# Altium schematic sheet ESP32_Schem_V2.SchDoc (part 3 of 4)
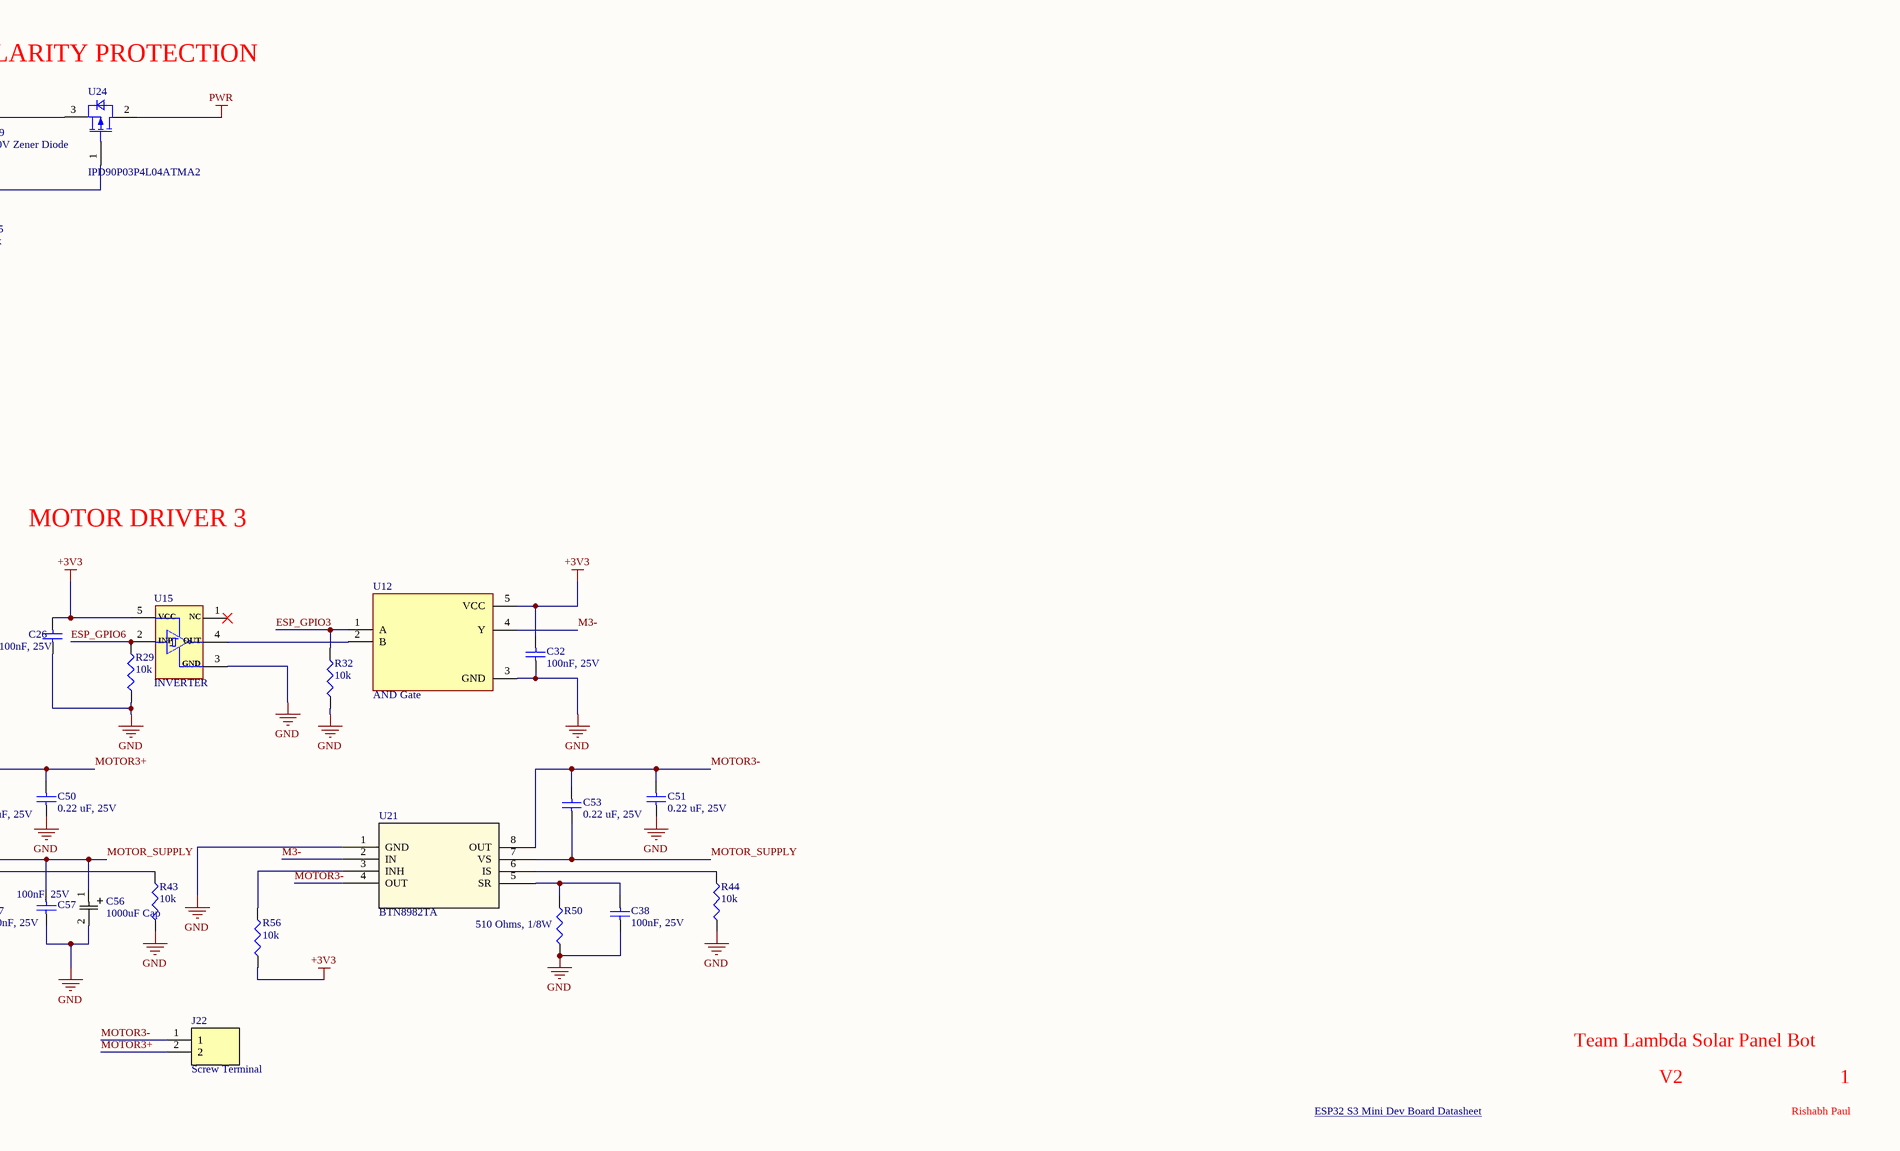
[diagram p5: ESP32_Schem_V2.SchDoc, bottom right]

## Library data of the parts (continued)
FB1 = BLM18AG601SN1D: FERRITE BEAD 600 OHM 0603 1LN; Manufacturer: Murata; Current Rating: 500mA; DC Resistance (DCR): 380mΩ; Frequency: 100MHz; Impedance: 600Ω; Material: Ferrite, Steel; Number of Circuits: 1; Value: 380mΩ; Shielding: Unshielded; Tolerance: 25%; Supplier: DigiKey; Supplier Part Number: 490-1014-1-ND; Manufacturer Part Number: BLM18AG601SN1D; RoHS: Compliant; Category: Ferrite Beads and Chips; Stock: 1399448; Pricing: 1=0.1, 10=0.057, 25=0.0496, 50=0.0446, 100=0.0401, 250=0.03456, 500=0.03076, 1000=0.02726 (USD); Case/Package: 0603; Case Code (Imperial): 0603; Case Code (Metric): 1608; Core Material: Ferrite; DC Current: 500mA; Depth: 800µm; Height: 800µm; Lead Free: Lead Free; Length: 1.6mm; Lifecycle Status: Production; Max Current Rating: 500mA; Max DC Current: 500mA; Clock Frequency: 100MHz; Max Operating Temperature: 125°C; Military Standard: Not; Min Operating Temperature: -55°C; Number of Lines: 1; Pins: 2; Number of Terminals: 2; Packaging: Cut Tape; Radiation Hardening: No; REACH SVHC: Yes; RMS Current (Irms): 500mA; Schedule B: 8543706000, 8543706000|8543706000, 8543706000|8543706000|8543706000, 8543706000|8543706000|8543706000|8543706000; ESR: 380mΩ; Termination: SMD/SMT; Test Frequency: 100MHz; Weight: 2.012816mg; Width: 800µm; ComponentLink1URL: https://datasheet.octopart.com:443/BLM18AG601SN1D-Murata-datasheet-180806579.pdf?src-supplier=IHS; ComponentLink1Description: https://datasheet.octopart.com:443/BLM18AG601SN1D-Murata-datasheet-180806579.pdf?src-supplier=IHS; ComponentLink2URL: https://datasheet.octopart.com:443/BLM18AG601SN1D-Murata-datasheet-41195.pdf?src-supplier=Upverter; ComponentLink2Description: https://datasheet.octopart.com:443/BLM18AG601SN1D-Murata-datasheet-41195.pdf?src-supplier=Upverter; ComponentLink3URL: https://datasheet.octopart.com:443/BLM18AG601SN1D-Murata-datasheet-11743096.pdf?src-supplier=Newark; ComponentLink3Description: https://datasheet.octopart.com:443/BLM18AG601SN1D-Murata-datasheet-11743096.pdf?src-supplier=Newark; ComponentLink4URL: https://datasheet.octopart.com:443/BLM18AG601SN1D-Murata-datasheet-5338592.pdf?src-supplier=Newark; ComponentLink4Description: https://datasheet.octopart.com:443/BLM18AG601SN1D-Murata-datasheet-5338592.pdf?src-supplier=Newark; ComponentLink5URL: https://datasheet.octopart.com:443/BLM18AG601SN1D-Murata-datasheet-511221.pdf?src-supplier=TME; ComponentLink5Description: https://datasheet.octopart.com:443/BLM18AG601SN1D-Murata-datasheet-511221.pdf?src-supplier=TME; ComponentLink6URL: https://datasheet.octopart.com:443/BLM18AG601SN1D-Murata-datasheet-135086656.pdf?src-supplier=TME; ComponentLink6Description: https://datasheet.octopart.com:443/BLM18AG601SN1D-Murata-datasheet-135086656.pdf?src-supplier=TME; ComponentLink7URL: https://datasheet.octopart.com:443/BLM18AG601SN1D-Murata-datasheet-5396529.pdf?src-supplier=Factory+Futures; ComponentLink7Description: https://datasheet.octopart.com:443/BLM18AG601SN1D-Murata-datasheet-5396529.pdf?src-supplier=Factory+Futures; ComponentLink8URL: https://datasheet.octopart.com:443/BLM18AG601SN1D-Murata-datasheet-141257898.pdf?src-supplier=Ciiva; ComponentLink8Description: https://datasheet.octopart.com:443/BLM18AG601SN1D-Murata-datasheet-141257898.pdf?src-supplier=Ciiva; ComponentLink9URL: https://datasheet.octopart.com:443/BLM18AG601SN1D-Murata-datasheet-138706784.pdf?src-supplier=Ciiva; ComponentLink9Description: https://datasheet.octopart.com:443/BLM18AG601SN1D-Murata-datasheet-138706784.pdf?src-supplier=Ciiva; ComponentLink10URL: https://datasheet.octopart.com:443/BLM18AG601SN1D-Murata-datasheet-78375072.pdf?src-supplier=Future+Electronics; ComponentLink10Description: https://datasheet.octopart.com:443/BLM18AG601SN1D-Murata-datasheet-78375072.pdf?src-supplier=Future+Electronics; ComponentLink11URL: https://datasheet.octopart.com:443/BLM18AG601SN1D-Murata-datasheet-58177255.pdf?src-supplier=Future+Electronics; ComponentLink11Description: https://datasheet.octopart.com:443/BLM18AG601SN1D-Murata-datasheet-58177255.pdf?src-supplier=Future+Electronics; ComponentLink12URL: https://datasheet.octopart.com/BLM18AG601SN1D-Murata-datasheet-37129980.pdf; ComponentLink12Description: https://datasheet.octopart.com/BLM18AG601SN1D-Murata-datasheet-37129980.pdf; ComponentLink13URL: https://datasheet.octopart.com:443/BLM18AG601SN1D-Murata-datasheet-14066397.pdf?src-supplier=iiiC; ComponentLink13Description: https://datasheet.octopart.com:443/BLM18AG601SN1D-Murata-datasheet-14066397.pdf?src-supplier=iiiC; ComponentLink14URL: https://datasheet.octopart.com:443/BLM18AG601SN1D-Murata-datasheet-9604654.pdf?src-supplier=RS+(Formerly+Allied+Electronics); ComponentLink14Description: https://datasheet.octopart.com:443/BLM18AG601SN1D-Murata-datasheet-9604654.pdf?src-supplier=RS+(Formerly+Allied+Electronics); ComponentLink15URL: https://datasheet.octopart.com:443/BLM18AG601SN1D-Murata-datasheet-13143.pdf?src-supplier=RS+(Formerly+Allied+Electronics); ComponentLink15Description: https://datasheet.octopart.com:443/BLM18AG601SN1D-Murata-datasheet-13143.pdf?src-supplier=RS+(Formerly+Allied+Electronics); ComponentLink16URL: https://datasheet.octopart.com:443/BLM18AG601SN1D-Murata-datasheet-7628479.pdf?src-supplier=Jameco; ComponentLink16Description: https://datasheet.octopart.com:443/BLM18AG601SN1D-Murata-datasheet-7628479.pdf?src-supplier=Jameco; ComponentLink17URL: https://datasheet.octopart.com:443/BLM18AG601SN1D-Murata-datasheet-11030792.pdf?src-supplier=Farnell; ComponentLink17Description: https://datasheet.octopart.com:443/BLM18AG601SN1D-Murata-datasheet-11030792.pdf?src-supplier=Farnell; ComponentLink18URL: http://sigma.octopart.com:80/reach_statement/Murata-company-16.pdf?src-supplier=Compliance+Statements; ComponentLink18Description: http://sigma.octopart.com:80/reach_statement/Murata-company-16.pdf?src-supplier=Compliance+Statements; LCSC Part Number: C19330
J3-J5 = BM04B-SRSS-TB: CONN HEADER SMD 4POS 1MM; Manufacturer: JST; Supplier: Digikey; Supplier Part Number: 455-BM04B-SRSS-TBCT-ND; Manufacturer Part Number: BM04B-SRSS-TB; RoHS: No; Category: Connectors; Stock: 53526; Pricing: 1=0.52, 10=0.44, 100=0.3739, 500=0.33366 (USD); ComponentLink1URL: https://datasheet.ciiva.com/6892/sr20connector-6892272.pdf?src-supplier=Digikey; ComponentLink1Description: https://datasheet.ciiva.com/6892/sr20connector-6892272.pdf?src-supplier=Digikey; LCSC Part Number: C160390
J6 J7 = B5B-XH-A: CONN HEADER VERT 5POS 2.5MM; Manufacturer: JST; Supplier: Digikey; Supplier Part Number: 455-B5B-XH-A-ND; Manufacturer Part Number: B5B-XH-A; RoHS: Yes; Category: FFC / FPC; Stock: 173083; Pricing: 1=0.17, 10=0.144, 100=0.1225, 500=0.10932, 1000=0.10409, 5000=0.0929, 10000=0.08847 (USD); ComponentLink1URL: https://www.distrelec.biz/Web/Downloads/_t/ds/xh-series_eng_tds.pdf?mime=application%2Fpdf&src-supplier=Distrelec; ComponentLink1Description: https://www.distrelec.biz/Web/Downloads/_t/ds/xh-series_eng_tds.pdf?mime=application%2Fpdf&src-supplier=Distrelec; LCSC Part Number: C157991
J8 = FTS-102-01-F-S: Board Connector, 2 Contact(s), 1 Row(s), Male, Straight, Solder Terminal; Manufacturer: Samtec; Manufacturer Series: FTS; Option: General Purpose; Additional Feature: Low Profile; Filter Feature: No; Number of Rows Loaded: 1; Number of Contacts: 2; Supplier: Digikey; Supplier Part Number: SAM15176-ND; Manufacturer Part Number: FTS-102-01-F-S; RoHS: Yes; Category: Connectors; Stock: 145; Pricing: 1=0.49, 50=0.4252, 100=0.3608, 500=0.2994, 1000=0.25609, 2000=0.252 (USD); Mounting Technology: Board; Contact Material: Bronze; Contact Finish - Mating: GOLD (3) OVER NICKEL (50); Contact Finish - Termination: Matte Tin (Sn) - with Nickel (Ni) barrier; Connector Type: BOARD CONNECTOR; JESD-609 Code: e3; Contact Gender: Male; Mixed Contacts: No; Mounting Style: STRAIGHT; Termination: Solder; Terminal Pitch: 1.27mm; Flammability Rating: UL94 V-0; DIN Conformance: No; IEC Conformance: No; MIL Conformance: No; Reach SVHC Compliant: Yes; RoHS Compliant: Yes; ComponentLink1URL: https://datasheet.ciiva.com:443/pdfs/VipMasterIC/IC/SAMI/SAMI-S-A0001504673/SAMI-S-A0001504673-1.pdf?src-supplier=IHS+Markit; ComponentLink1Description: https://datasheet.ciiva.com:443/pdfs/VipMasterIC/IC/SAMI/SAMI-S-A0001504673/SAMI-S-A0001504673-1.pdf?src-supplier=IHS+Markit; ComponentLink2URL: http://www.samtec.com/documents/webfiles/pdf/FTS.pdf?src-supplier=Avnet; ComponentLink2Description: http://www.samtec.com/documents/webfiles/pdf/FTS.pdf?src-supplier=Avnet; ComponentLink3URL: https://datasheet.octopart.com/FTS-102-01-F-S-Samtec-datasheet-118493358.pdf?src-supplier=Electro+Sonic; ComponentLink3Description: https://datasheet.octopart.com/FTS-102-01-F-S-Samtec-datasheet-118493358.pdf?src-supplier=Electro+Sonic; LCSC Part Number: C6045317
J10 J19 J20 J22 J23 = TB005-762-02BE: 2~24 Poles, Screw Type, Horizontal, 7.62 Pitch, 26~10 (AWG), Terminal Block Connector; Manufacturer: Same Sky; Approvals: CE, EN, IEC, UL, cUL; Current Rating: 30A; Number of Contacts: 2; Number of Levels: 1; Pitch: 7.62mm; Voltage Rating: 300V; Wire/Cable Gauge: 10AWG; Supplier: DigiKey; Supplier Part Number: 102-6189-ND; Manufacturer Part Number: TB005-762-02BE; RoHS: Compliant; Category: Terminal Blocks; Stock: 25079; Pricing: 1=0.78, 10=0.574, 25=0.5, 50=0.4504, 100=0.4073, 250=0.36028, 600=0.3253, 1200=0.30358, 5400=0.27068 (USD); Color: Blue; Height: 21.7mm; Lifecycle Status: Production; Max Operating Temperature: 105°C; Min Operating Temperature: -40°C; Mounting Technology: Screw; Number of Rows: 1; Orientation: Horizontal; REACH SVHC: No; Width: 12.6mm; ComponentLink1URL: https://datasheet.octopart.com:443/TB005-762-02BE-Same-Sky-datasheet-181920257.pdf?src-supplier=Same+Sky; ComponentLink1Description: https://datasheet.octopart.com:443/TB005-762-02BE-Same-Sky-datasheet-181920257.pdf?src-supplier=Same+Sky; ComponentLink2URL: https://datasheet.octopart.com:443/TB005-762-02BE-Same-Sky-datasheet-181920256.pdf?src-supplier=Same+Sky; ComponentLink2Description: https://datasheet.octopart.com:443/TB005-762-02BE-Same-Sky-datasheet-181920256.pdf?src-supplier=Same+Sky; ComponentLink3URL: https://datasheet.octopart.com:443/TB005-762-02BE-CUI-Devices-datasheet-175928138.pdf?src-supplier=Same+Sky; ComponentLink3Description: https://datasheet.octopart.com:443/TB005-762-02BE-CUI-Devices-datasheet-175928138.pdf?src-supplier=Same+Sky; ComponentLink4URL: https://datasheet.octopart.com:443/TB005-762-02BE-CUI-Devices-datasheet-144794958.pdf?src-supplier=Same+Sky; ComponentLink4Description: https://datasheet.octopart.com:443/TB005-762-02BE-CUI-Devices-datasheet-144794958.pdf?src-supplier=Same+Sky; ComponentLink5URL: https://datasheet.octopart.com:443/TB005-762-02BE-CUI-Devices-datasheet-180438487.pdf?src-supplier=IHS; ComponentLink5Description: https://datasheet.octopart.com:443/TB005-762-02BE-CUI-Devices-datasheet-180438487.pdf?src-supplier=IHS; ComponentLink6URL: https://datasheet.octopart.com:443/TB005-762-02BE-Same-Sky-datasheet-182881445.pdf?src-supplier=Electro+Sonic; ComponentLink6Description: https://datasheet.octopart.com:443/TB005-762-02BE-Same-Sky-datasheet-182881445.pdf?src-supplier=Electro+Sonic; ComponentLink7URL: https://datasheet.octopart.com:443/TB005-762-02BE-CUI-Devices-datasheet-154730746.pdf?src-supplier=Electro+Sonic; ComponentLink7Description: https://datasheet.octopart.com:443/TB005-762-02BE-CUI-Devices-datasheet-154730746.pdf?src-supplier=Electro+Sonic; ComponentLink8URL: https://datasheet.octopart.com:443/TB005-762-02BE-CUI-Devices-datasheet-175927971.pdf?src-supplier=CUI+Devices+SCT; ComponentLink8Description: https://datasheet.octopart.com:443/TB005-762-02BE-CUI-Devices-datasheet-175927971.pdf?src-supplier=CUI+Devices+SCT; ComponentLink9URL: https://datasheet.octopart.com:443/TB005-762-02BE-CUI-Devices-datasheet-142371921.pdf?src-supplier=Future+Electronics; ComponentLink9Description: https://datasheet.octopart.com:443/TB005-762-02BE-CUI-Devices-datasheet-142371921.pdf?src-supplier=Future+Electronics; ComponentLink10URL: https://datasheet.octopart.com:443/TB005-762-02BE-Same-Sky-datasheet-182050252.pdf?src-supplier=Future+Electronics; ComponentLink10Description: https://datasheet.octopart.com:443/TB005-762-02BE-Same-Sky-datasheet-182050252.pdf?src-supplier=Future+Electronics; ComponentLink11URL: https://datasheet.octopart.com:443/TB005-762-02BE-CUI-Devices-datasheet-175928503.pdf?src-supplier=Future+Electronics; ComponentLink11Description: https://datasheet.octopart.com:443/TB005-762-02BE-CUI-Devices-datasheet-175928503.pdf?src-supplier=Future+Electronics; ComponentLink12URL: https://datasheet.octopart.com:443/TB005-762-02BE-CUI-Devices-datasheet-147843964.pdf?src-supplier=Future+Electronics; ComponentLink12Description: https://datasheet.octopart.com:443/TB005-762-02BE-CUI-Devices-datasheet-147843964.pdf?src-supplier=Future+Electronics; ComponentLink13URL: https://datasheet.octopart.com:443/TB005-762-02BE-Same-Sky-datasheet-189105715.pdf?src-supplier=Master+Electronics; ComponentLink13Description: https://datasheet.octopart.com:443/TB005-762-02BE-Same-Sky-datasheet-189105715.pdf?src-supplier=Master+Electronics; ComponentLink14URL: https://octopart.com:443/opatz8j6/c1?t=UaLs9BzQFnAOJB9prTnk7hYAEqibQSv_UZhUrY86DPf-p0P0hX05E_pze_DW6cL4J_MzA2LUb1YOWKK86-5mpMQQU3DWYVuZIoukJg4Hh9bczH7CnkQxGFzuqKqtirzWJe-6GAELDRl62KmKpAdnnPg1TQOtKshj70we-Zluz0qtI-26UObxFmwPsUgEbo_7o4hJKMXvNacg0FBUhbjGVTtEzE_3AW52qU7r6OuDn6MyCvvcIhP6l0xxBDI7L6vG1RQTPJKu5j4wHDn_7LFUbOdZOzPXgt-E1wVzunH8sE2WAnC8CwCpFNFDDf2LEElRT3GQEArGzVR9jHU4ckIzmEN6zODhzVqwCy90tTlm&src-supplier=Compliance+Statements; ComponentLink14Description: https://octopart.com:443/opatz8j6/c1?t=UaLs9BzQFnAOJB9prTnk7hYAEqibQSv_UZhUrY86DPf-p0P0hX05E_pze_DW6cL4J_MzA2LUb1YOWKK86-5mpMQQU3DWYVuZIoukJg4Hh9bczH7CnkQxGFzuqKqtirzWJe-6GAELDRl62KmKpAdnnPg1TQOtKshj70we-Zluz0qtI-26UObxFmwPsUgEbo_7o4hJKMXvNacg0FBUhbjGVTtEzE_3AW52qU7r6OuDn6MyCvvcIhP6l0xxBDI7L6vG1RQTPJKu5j4wHDn_7LFUbOdZOzPXgt-E1wVzunH8sE2WAnC8CwCpFNFDDf2LEElRT3GQEArGzVR9jHU4ckIzmEN6zODhzVqwCy90tTlm&src-supplier=Compliance+Statements; ComponentLink15URL: https://octopart.com:443/opatz8j6/c1?t=DnoQ13F0DlpqmGN8T_YXuK1tRMjg7pOtrEexqg8E5gzx3sX052Z7C9OransOEA1B1UKr9za9I5GPF3spWl0seeHLvZoR3j5pxqaHFy_IKDPQmLXnkoJAym92fy25UN33V-8Qm6tbHVt5VO_bllWVtdDekc0YECabXnkKPqjitvax55qCo91aF91MvdJWz6TDxIrCDIwXhNHgV3TM4Wj5aU3mEGqXoFgBytK3VCRqYa7hOyW9naNxJLLkwI4ACkSaLfD6gpPqjencvKCWF0Lf8nWVAbEAGs7-_nreDZocLrEZI-9ZfwSveC2jq_y-Kh72xlf7IlgtV_ZwQpY6ti08_7N9ZHeZ6iN9_D3cDOu3zpL8bA&src-supplier=Compliance+Statements; ComponentLink15Description: https://octopart.com:443/opatz8j6/c1?t=DnoQ13F0DlpqmGN8T_YXuK1tRMjg7pOtrEexqg8E5gzx3sX052Z7C9OransOEA1B1UKr9za9I5GPF3spWl0seeHLvZoR3j5pxqaHFy_IKDPQmLXnkoJAym92fy25UN33V-8Qm6tbHVt5VO_bllWVtdDekc0YECabXnkKPqjitvax55qCo91aF91MvdJWz6TDxIrCDIwXhNHgV3TM4Wj5aU3mEGqXoFgBytK3VCRqYa7hOyW9naNxJLLkwI4ACkSaLfD6gpPqjencvKCWF0Lf8nWVAbEAGs7-_nreDZocLrEZI-9ZfwSveC2jq_y-Kh72xlf7IlgtV_ZwQpY6ti08_7N9ZHeZ6iN9_D3cDOu3zpL8bA&src-supplier=Compliance+Statements; ComponentLink16URL: https://octopart.com:443/opatz8j6/c1?t=9TOIpc8Qr-PjoInF58_SetXl4A-zcD2bg-RG2s0eGx3VZJ_3ffKwdLF0jkFcls3hR0nNbTXhk3LbUTlV1wcsn2gUmTNq_ymOT4yZcUsxc4MnTfKTQUXl8BiPhcap6BnyTO4DP62xPlcbfDdOl1kdyUnwLJKClBaAfVfvVHvvu8Dg5xKYLUwzSzHOVNnhawJNiUJdYmvbYXoByG5W0OcRVNpAAEvWODy5ARTJtlpfI1W4UHjPZ1NOhOXf6h4eMswP7ZdtGUQDglbSWcDc-Kt2pCaeZ17Pt05QbPX0un0LSt1LSPowuvCYICYvdiB4Rp6OR5QS3GWcy18acTGixr9Sk1CdixVzswMZQndrdbpP&src-supplier=Compliance+Statements; ComponentLink16Description: https://octopart.com:443/opatz8j6/c1?t=9TOIpc8Qr-PjoInF58_SetXl4A-zcD2bg-RG2s0eGx3VZJ_3ffKwdLF0jkFcls3hR0nNbTXhk3LbUTlV1wcsn2gUmTNq_ymOT4yZcUsxc4MnTfKTQUXl8BiPhcap6BnyTO4DP62xPlcbfDdOl1kdyUnwLJKClBaAfVfvVHvvu8Dg5xKYLUwzSzHOVNnhawJNiUJdYmvbYXoByG5W0OcRVNpAAEvWODy5ARTJtlpfI1W4UHjPZ1NOhOXf6h4eMswP7ZdtGUQDglbSWcDc-Kt2pCaeZ17Pt05QbPX0un0LSt1LSPowuvCYICYvdiB4Rp6OR5QS3GWcy18acTGixr9Sk1CdixVzswMZQndrdbpP&src-supplier=Compliance+Statements; ComponentLink17URL: https://octopart.com:443/opatz8j6/c1?t=3V4tUB9kiYrWGahfebCrvcXlmg8iqF7sOAlCR_IUY1WwO2F75QSEOxDuLjKYVwOKylXrvvAE0jhvyxpY5kpkHqUuzaMRj71z5KzuQkpAngx-BdZlTUzZtYpvhoyf9gXv6BqVIVx6Lus7sZ4tMtHFDPJOpaCFtvYA__49iWvip8OBtn2jUAviupDwUVxZ3ovJ42WilRB767x17euwvMlr75_c4O8Lf_S7SD5GFBqRkxeFqIQWstxwZM20vhpFCia3KeU3jEgmGWsk6Gphu4sZVVI-8_cX-rxiwCWaSbFipS2rdSeaRV-fARs0Qm9gBHXX2FNK0VQTZmSv-MV2ywYDx4-u10J-zFhb313JbJN9nWfhrw&src-supplier=Compliance+Statements; ComponentLink17Description: https://octopart.com:443/opatz8j6/c1?t=3V4tUB9kiYrWGahfebCrvcXlmg8iqF7sOAlCR_IUY1WwO2F75QSEOxDuLjKYVwOKylXrvvAE0jhvyxpY5kpkHqUuzaMRj71z5KzuQkpAngx-BdZlTUzZtYpvhoyf9gXv6BqVIVx6Lus7sZ4tMtHFDPJOpaCFtvYA__49iWvip8OBtn2jUAviupDwUVxZ3ovJ42WilRB767x17euwvMlr75_c4O8Lf_S7SD5GFBqRkxeFqIQWstxwZM20vhpFCia3KeU3jEgmGWsk6Gphu4sZVVI-8_cX-rxiwCWaSbFipS2rdSeaRV-fARs0Qm9gBHXX2FNK0VQTZmSv-MV2ywYDx4-u10J-zFhb313JbJN9nWfhrw&src-supplier=Compliance+Statements; LCSC Part Number: C5873515
J13 J17 = 1725656: Block, Terminal; 6 A; 63 V; 2.54 mm; 26 to 20 AWG; 2; Screw; Soldering; 1.5 kV; Manufacturer: Phoenix Contact; Approvals: CSA, UL, VDE, cUL; Connector Type: PCB, Screw, Terminal Block; Current: 6A; Max Supply Voltage: 63V; Number of Circuits: 2; Number of Levels: 1; Pitch: 2.54mm; Stripping Length: 4.5mm; Voltage: 125V; Voltage Rating: 160V; Wire/Cable Gauge: 20AWG; Wire Gauge (Max): 26AWG; Supplier: DigiKey; Supplier Part Number: 277-1273-ND; Manufacturer Part Number: 1725656; RoHS: Compliant; Category: Terminal Blocks; Stock: 21108; Pricing: 1=1.93, 10=1.379, 25=1.2736 (USD); ComponentLink1URL: https://datasheet.octopart.com:443/1725656-Phoenix-Contact-datasheet-141439143.pdf?src-supplier=Upverter; ComponentLink1Description: https://datasheet.octopart.com:443/1725656-Phoenix-Contact-datasheet-141439143.pdf?src-supplier=Upverter; ComponentLink2URL: https://datasheet.octopart.com:443/1725656-Phoenix-Contact-datasheet-101586919.pdf?src-supplier=element14+APAC; ComponentLink2Description: https://datasheet.octopart.com:443/1725656-Phoenix-Contact-datasheet-101586919.pdf?src-supplier=element14+APAC; China RoHS: Compliant; Color: Green; Contact Material: Tin; Current Rating: 6A; Depth: 6.2mm; Flammability Rating: UL94 V-0; Height: 6.2mm; Housing Color: Green; Insulation Material: Nylon; Lead Free: Lead Free; Lead Pitch: 2.54mm; Lifecycle Status: Production; Max Current Rating: 6A; Mounting Technology: Screw; Number of Contacts: 2; Pins: 2; Number of Poles: 2; Number of Positions: 2; Number of Positions Per Level: 2; Number of Rows: 1; Radiation Hardening: No; REACH SVHC: Yes; Termination: Solder; Voltage Rating (AC): 63V; Weight: 639.990485mg; Width: 12mm; Wire Gauge (Min): 20AWG; ComponentLink3URL: https://datasheet.octopart.com:443/1725656-Phoenix-Contact-datasheet-5302866.pdf?src-supplier=element14+APAC; ComponentLink3Description: https://datasheet.octopart.com:443/1725656-Phoenix-Contact-datasheet-5302866.pdf?src-supplier=element14+APAC; ComponentLink4URL: https://datasheet.octopart.com:443/1725656-Phoenix-Contact-datasheet-66629008.pdf?src-supplier=element14+APAC; ComponentLink4Description: https://datasheet.octopart.com:443/1725656-Phoenix-Contact-datasheet-66629008.pdf?src-supplier=element14+APAC; ComponentLink5URL: https://datasheet.octopart.com:443/1725656-Phoenix-Contact-datasheet-170281659.pdf?src-supplier=Master+Electronics; ComponentLink5Description: https://datasheet.octopart.com:443/1725656-Phoenix-Contact-datasheet-170281659.pdf?src-supplier=Master+Electronics; ComponentLink6URL: https://datasheet.octopart.com:443/1725656-Phoenix-Contact-datasheet-154778688.pdf?src-supplier=Electro+Sonic; ComponentLink6Description: https://datasheet.octopart.com:443/1725656-Phoenix-Contact-datasheet-154778688.pdf?src-supplier=Electro+Sonic; ComponentLink7URL: https://datasheet.octopart.com:443/1725656-Phoenix-Contact-datasheet-525036.pdf?src-supplier=Newark; ComponentLink7Description: https://datasheet.octopart.com:443/1725656-Phoenix-Contact-datasheet-525036.pdf?src-supplier=Newark; ComponentLink8URL: https://datasheet.octopart.com:443/1725656-Phoenix-Contact-datasheet-169855803.pdf?src-supplier=Amar+Radio+Corporation; ComponentLink8Description: https://datasheet.octopart.com:443/1725656-Phoenix-Contact-datasheet-169855803.pdf?src-supplier=Amar+Radio+Corporation; ComponentLink9URL: https://datasheet.octopart.com:443/1725656-Phoenix-Contact-datasheet-164874127.pdf?src-supplier=Burklin+Elektronik; ComponentLink9Description: https://datasheet.octopart.com:443/1725656-Phoenix-Contact-datasheet-164874127.pdf?src-supplier=Burklin+Elektronik; ComponentLink10URL: https://datasheet.octopart.com:443/1725656-Phoenix-Contact-datasheet-62053918.pdf?src-supplier=TME; ComponentLink10Description: https://datasheet.octopart.com:443/1725656-Phoenix-Contact-datasheet-62053918.pdf?src-supplier=TME; ComponentLink11URL: https://datasheet.octopart.com:443/1725656-Phoenix-Contact-datasheet-11891466.pdf?src-supplier=Arrow+Electronics; ComponentLink11Description: https://datasheet.octopart.com:443/1725656-Phoenix-Contact-datasheet-11891466.pdf?src-supplier=Arrow+Electronics; ComponentLink12URL: https://datasheet.octopart.com:443/1725656-Phoenix-Contact-datasheet-33456951.pdf?src-supplier=MRO+Stop; ComponentLink12Description: https://datasheet.octopart.com:443/1725656-Phoenix-Contact-datasheet-33456951.pdf?src-supplier=MRO+Stop; ComponentLink13URL: https://datasheet.octopart.com:443/1725656-Phoenix-Contact-datasheet-62122436.pdf?src-supplier=RS+(Formerly+Allied+Electronics); ComponentLink13Description: https://datasheet.octopart.com:443/1725656-Phoenix-Contact-datasheet-62122436.pdf?src-supplier=RS+(Formerly+Allied+Electronics); ComponentLink14URL: https://datasheet.octopart.com:443/1725656-Phoenix-Contact-datasheet-9781713.pdf?src-supplier=RS+(Formerly+Allied+Electronics); ComponentLink14Description: https://datasheet.octopart.com:443/1725656-Phoenix-Contact-datasheet-9781713.pdf?src-supplier=RS+(Formerly+Allied+Electronics); ComponentLink15URL: https://datasheet.octopart.com:443/1725656-Phoenix-Contact-datasheet-84491.pdf?src-supplier=RS+(Formerly+Allied+Electronics); ComponentLink15Description: https://datasheet.octopart.com:443/1725656-Phoenix-Contact-datasheet-84491.pdf?src-supplier=RS+(Formerly+Allied+Electronics); ComponentLink16URL: https://datasheet.octopart.com:443/1725656-Phoenix-Contact-datasheet-657280.pdf?src-supplier=Farnell; ComponentLink16Description: https://datasheet.octopart.com:443/1725656-Phoenix-Contact-datasheet-657280.pdf?src-supplier=Farnell; ComponentLink17URL: https://datasheet.octopart.com:443/1725656-Phoenix-Contact-datasheet-97278.pdf?src-supplier=DigiKey; ComponentLink17Description: https://datasheet.octopart.com:443/1725656-Phoenix-Contact-datasheet-97278.pdf?src-supplier=DigiKey; LCSC Part Number: C3029316
J14 = FTS-103-01-F-S: Board Connector, 3 Contact(s), 1 Row(s), Male, Straight, Solder Terminal; Manufacturer: Samtec; Manufacturer Series: FTS; Option: General Purpose; Additional Feature: Low Profile; Filter Feature: No; Number of Rows Loaded: 1; Number of Contacts: 3; Supplier: Digikey; Supplier Part Number: 612-FTS-103-01-F-S-ND; Manufacturer Part Number: FTS-103-01-F-S; RoHS: Yes; Category: Connectors; Stock: 1328; Pricing: 1=0.73, 50=0.6378, 100=0.5407, 500=0.4491, 1000=0.38362, 2000=0.31431, 5000=0.2478, 10000=0.228 (USD); Mounting Technology: Board; Contact Material: Bronze; Contact Finish - Mating: GOLD (3) OVER NICKEL (50); Contact Finish - Termination: Matte Tin (Sn) - with Nickel (Ni) barrier; Connector Type: BOARD CONNECTOR; JESD-609 Code: e3; Contact Gender: Male; Mixed Contacts: No; Mounting Style: STRAIGHT; Termination: Solder; Terminal Pitch: 1.27mm; Flammability Rating: UL94 V-0; DIN Conformance: No; IEC Conformance: No; MIL Conformance: No; Reach SVHC Compliant: Yes; RoHS Compliant: Yes; ComponentLink1URL: https://datasheet.ciiva.com:443/pdfs/VipMasterIC/IC/SAMI/SAMI-S-A0001504673/SAMI-S-A0001504673-1.pdf?src-supplier=IHS+Markit; ComponentLink1Description: https://datasheet.ciiva.com:443/pdfs/VipMasterIC/IC/SAMI/SAMI-S-A0001504673/SAMI-S-A0001504673-1.pdf?src-supplier=IHS+Markit; ComponentLink2URL: http://suddendocs.samtec.com/prints/fts-1xx-xx-xx-xx-xx-mkt.pdf?src-supplier=Digikey; ComponentLink2Description: http://suddendocs.samtec.com/prints/fts-1xx-xx-xx-xx-xx-mkt.pdf?src-supplier=Digikey; ComponentLink3URL: http://www.samtec.com/documents/webfiles/pdf/FTS.pdf?src-supplier=Avnet; ComponentLink3Description: http://www.samtec.com/documents/webfiles/pdf/FTS.pdf?src-supplier=Avnet; ComponentLink4URL: https://datasheet.octopart.com/FTS-103-01-F-S-Samtec-datasheet-116535195.pdf?src-supplier=Toby+Electronics; ComponentLink4Description: https://datasheet.octopart.com/FTS-103-01-F-S-Samtec-datasheet-116535195.pdf?src-supplier=Toby+Electronics; ComponentLink5URL: https://datasheet.octopart.com/FTS-103-01-F-S-Samtec-datasheet-151470456.pdf?src-supplier=Sager+Electronics; ComponentLink5Description: https://datasheet.octopart.com/FTS-103-01-F-S-Samtec-datasheet-151470456.pdf?src-supplier=Sager+Electronics; ComponentLink6URL: https://datasheet.octopart.com/FTS-103-01-F-S-Samtec-datasheet-118493358.pdf?src-supplier=Electro+Sonic; ComponentLink6Description: https://datasheet.octopart.com/FTS-103-01-F-S-Samtec-datasheet-118493358.pdf?src-supplier=Electro+Sonic; LCSC Part Number: C3333578
J18 = 217179-0001: USB Connector, 16 Contact(s), Female, Right Angle, Surface Mount Terminal, Locking, Receptacle; Manufacturer: Molex; Supplier: Digikey; Supplier Part Number: 900-2171790001CT-ND; Manufacturer Part Number: 217179-0001; RoHS: No; Category: Connectors; Stock: 25209; Pricing: 1=0.83, 10=0.704, 25=0.6596, 50=0.628, 100=0.598, 250=0.56052, 500=0.53374 (USD); LCSC Part Number: C3197684
L1 = VLS6045EX-3R3N: FIXED IND 3.3UH 4.95A 30MOHM SMD; Manufacturer: TDK; Core Material: Ferrite; Tolerance: 30%; Case/Size Code: 2424; DC Resistance (DCR): 23mR; Inductor Application: POWER INDUCTOR; Inductor Type: GENERAL PURPOSE INDUCTOR; Channels: 1; Shape/Size Description: RECTANGULAR PACKAGE; Shielding: Shielded; Test Frequency: 100kHz; Package Height: 4.5mm; Package Length: 6mm; Supplier: Digikey; Supplier Part Number: 445-173052-1-ND; Manufacturer Part Number: VLS6045EX-3R3N; RoHS: Yes; Category: Fixed Inductors; Stock: 79866; Pricing: 1=0.34, 10=0.284, 100=0.2333 (USD); Pins: 2; Min Operating Temperature: -40°C; Max Operating Temperature: 105°C; Construction: Rectangular; Inductance-Nom (L): 3.3uH; Package Style: SMTMeter; Packaging: Tape and Reel; Max Current Rating: 4.95A; Surface Mount: Yes; Terminal Placement: Dual Ended; Termination: One Surface; Package Width: 6mm; Reach SVHC Compliant: Yes; RoHS Compliant: Yes; ComponentLink1URL: https://datasheet.ciiva.com:443/pdfs/VipMasterIC/IC/TDKC/TDKC-S-A0006138306/TDKC-S-A0006138306-1.pdf?src-supplier=IHS+Markit; ComponentLink1Description: https://datasheet.ciiva.com:443/pdfs/VipMasterIC/IC/TDKC/TDKC-S-A0006138306/TDKC-S-A0006138306-1.pdf?src-supplier=IHS+Markit; ComponentLink2URL: https://media.digikey.com/pdf/Data%20Sheets/TDK%20PDFs/VLS-EX_Series_Br.pdf?src-supplier=Digikey; ComponentLink2Description: https://media.digikey.com/pdf/Data%20Sheets/TDK%20PDFs/VLS-EX_Series_Br.pdf?src-supplier=Digikey; ComponentLink3URL: http://www.farnell.com/datasheets/2294922.pdf?src-supplier=Farnell; ComponentLink3Description: http://www.farnell.com/datasheets/2294922.pdf?src-supplier=Farnell; LCSC Part Number: C307879
LINK1 = M50-1920005: Interconnection Device; Manufacturer: Harwin; Manufacturer Series: M50; Body/Shell Style: PLUG; Contact Pattern: RECTANGULAR; Contact Resistance: 20mR; Dielectric Withstanding Voltage (AC): 500V; Durability: 300Cycles; Insulation Resistance: 1GR; Number Of Connectors: 1; Rated Current (Signal): 1A; Number of Contacts: 2; Body Breadth: 0.059inch; Body Depth: 0.118inch; Body Length: 0.098inch; Mating Contact Pitch: 0.05inch; Reference Standard: UL; Reliability: COMMERCIAL; Supplier: Digikey; Supplier Part Number: 952-1727-ND; Manufacturer Part Number: M50-1920005; RoHS: Yes; Category: Headers and Wire Housings; Stock: 4367; Pricing: 1=0.33, 10=0.284, 25=0.2664, 50=0.2536, 100=0.2414, 250=0.22628, 500=0.21546, 1000=0.20516, 3000=0.18984 (USD); Contact Material: Copper Alloy; Contact Finish - Mating: AU ON NI; Contact Finish - Termination: Gold (Au); Insulation Color: Red; Insulation Material: Nylon; Min Operating Temperature: -40°C; Max Operating Temperature: 105°C; Connector Type: Interconnection Device; JESD-609 Code: e4; Contact Gender: Female; Mounting Style: STRAIGHT; Number of Rows Loaded: 1; Reach SVHC Compliant: Yes; RoHS Compliant: Yes; ComponentLink1URL: https://datasheet.ciiva.com:443/pdfs/VipMasterIC/IC/HRWN/HRWNS04645/HRWNS04645-1.pdf?src-supplier=IHS+Markit; ComponentLink1Description: https://datasheet.ciiva.com:443/pdfs/VipMasterIC/IC/HRWN/HRWNS04645/HRWNS04645-1.pdf?src-supplier=IHS+Markit; ComponentLink2URL: https://datasheet.ciiva.com/4573/m50-19x-350826-4573042.pdf?src-supplier=Mouser; ComponentLink2Description: https://datasheet.ciiva.com/4573/m50-19x-350826-4573042.pdf?src-supplier=Mouser; ComponentLink3URL: https://datasheet.ciiva.com/767/m50-19x-767921.pdf?src-supplier=Digikey; ComponentLink3Description: https://datasheet.ciiva.com/767/m50-19x-767921.pdf?src-supplier=Digikey; ComponentLink4URL: https://datasheet.ciiva.com/1456/m50-19x-1456640.pdf?src-supplier=Newark; ComponentLink4Description: https://datasheet.ciiva.com/1456/m50-19x-1456640.pdf?src-supplier=Newark; ComponentLink5URL: https://datasheet.ciiva.com/1412/1836978-1412125.pdf?src-supplier=Element14; ComponentLink5Description: https://datasheet.ciiva.com/1412/1836978-1412125.pdf?src-supplier=Element14; LCSC Part Number: C6985646
Q1 Q2 = SS8050-G: Small Signal Bipolar Transistor, 1.5A I(C), 25V V(BR)CEO, 1-Element, NPN, Silicon; Manufacturer: Comchip; Supplier: Digikey; Supplier Part Number: 641-1790-1-ND; Manufacturer Part Number: SS8050-G; RoHS: Yes; Category: Transistors; Stock: 99722; Pricing: 1=0.24, 10=0.148, 100=0.0921, 500=0.06754, 1000=0.05958 (USD); Reach SVHC Compliant: Yes; RoHS Compliant: Yes; ComponentLink1URL: https://datasheet.ciiva.com:443/pdfs/VipMasterIC/IC/COMC/COMC-S-A0004994192/COMC-S-A0004994192-1.pdf?src-supplier=IHS+Markit; ComponentLink1Description: https://datasheet.ciiva.com:443/pdfs/VipMasterIC/IC/COMC/COMC-S-A0004994192/COMC-S-A0004994192-1.pdf?src-supplier=IHS+Markit; ComponentLink2URL: http://www.comchiptech.com/admin/files/product/SS8050-G RevA181526.pdf?src-supplier=Digikey; ComponentLink2Description: http://www.comchiptech.com/admin/files/product/SS8050-G RevA181526.pdf?src-supplier=Digikey; LCSC Part Number: C164886
R1 R13 R14 R26 = AC0402FR-0710KL: Fixed Resistor, Metal Glaze/thick Film, 0.0625W, 10000ohm, 50V, 1% +/-Tol, 100ppm/Cel, Surface Mount, 0402; Manufacturer: Yageo; Additional Feature: LASER TRIMMABLE; Power: 62.5mW; Rated Temperature: 70°C; Value: 10kR; Temperature Coefficient (ppm/Cel): 100; Package Height: 0.32mm; Package Length: 1mm; Package Width: 0.5mm; Reference Standard: AEC-Q200; Supplier: Digikey; Supplier Part Number: YAG3436CT-ND; Manufacturer Part Number: AC0402FR-0710KL; RoHS: Yes; Category: Chip SMD Resistors; Stock: 750136; Pricing: 1=0.1, 10=0.009, 100=0.0082, 1000=0.00612, 2500=0.0051 (USD); Mounting Technology: Surface Mount; Pins: 2; Package Shape: Rectangular; Case/Package: 0402; Terminal Finish: Nickel; Min Operating Temperature: -55°C; Max Operating Temperature: 155°C; Tolerance: 1%; JESD-609 Code: e3; Resistor Type: FIXED RESISTOR; Construction: Chip; Packaging: Tape and Reel; Technology: METAL GLAZE/THICK FILM; Termination: Wraparound; Working Voltage: 50V; Reach SVHC Compliant: Yes; RoHS Compliant: Yes; ComponentLink1URL: https://datasheet.ciiva.com:443/pdfs/VipMasterIC/IC/YAGO/YAGO-S-A0003597364/YAGO-S-A0003597364-1.pdf?src-supplier=IHS+Markit; ComponentLink1Description: https://datasheet.ciiva.com:443/pdfs/VipMasterIC/IC/YAGO/YAGO-S-A0003597364/YAGO-S-A0003597364-1.pdf?src-supplier=IHS+Markit; ComponentLink2URL: https://datasheet.ciiva.com/12656/pyu-ac-51-rohs-l-2-12656634.pdf?src-supplier=Mouser; ComponentLink2Description: https://datasheet.ciiva.com/12656/pyu-ac-51-rohs-l-2-12656634.pdf?src-supplier=Mouser; LCSC Part Number: C144807
R2 R3 = RC0402FR-071KL: Fixed Resistor, Metal Glaze/thick Film, 0.0625W, 1000ohm, 50V, 1% +/-Tol, 100ppm/Cel, Surface Mount, 0402; Manufacturer: Yageo; Additional Feature: LASER TRIMMABLE; Power: 62.5mW; Rated Temperature: 70°C; Value: 1kR; Temperature Coefficient (ppm/Cel): 100; Package Height: 0.35mm; Package Length: 1mm; Package Width: 0.5mm; Supplier: Digikey; Supplier Part Number: 311-1.00KLRCT-ND; Manufacturer Part Number: RC0402FR-071KL; RoHS: Yes; Category: Chip SMD Resistors; Stock: 3246928; Pricing: 1=0.1, 10=0.007, 100=0.0061, 1000=0.0051, 2500=0.00408, 10000=0.00204, 20000=0.002, 30000=0.00181, 50000=0.0017, 70000=0.00161 (USD); Mounting Technology: Surface Mount; Pins: 2; Package Shape: Rectangular; Case/Package: 0402; Terminal Finish: Nickel; Min Operating Temperature: -55°C; Max Operating Temperature: 155°C; Tolerance: 1%; JESD-609 Code: e3; Resistor Type: FIXED RESISTOR; Construction: Chip; Packaging: Tape and Reel; Technology: METAL GLAZE/THICK FILM; Termination: Wraparound; Working Voltage: 50V; Reach SVHC Compliant: Yes; RoHS Compliant: Yes; ComponentLink1URL: https://datasheet.ciiva.com:443/pdfs/VipMasterIC/IC/YAGO/YAGO-S-A0008145938/YAGO-S-A0008145938-1.pdf?src-supplier=IHS+Markit; ComponentLink1Description: https://datasheet.ciiva.com:443/pdfs/VipMasterIC/IC/YAGO/YAGO-S-A0008145938/YAGO-S-A0008145938-1.pdf?src-supplier=IHS+Markit; ComponentLink2URL: https://datasheet.ciiva.com/11819/0900766b80c66297-11819477.pdf?src-supplier=Rs; ComponentLink2Description: https://datasheet.ciiva.com/11819/0900766b80c66297-11819477.pdf?src-supplier=Rs; ComponentLink3URL: https://datasheet.ciiva.com/22747/1018594-22747513.pdf?src-supplier=Element14; ComponentLink3Description: https://datasheet.ciiva.com/22747/1018594-22747513.pdf?src-supplier=Element14; ComponentLink4URL: https://datasheet.ciiva.com/12666/pyu-rc0402-51-rohs-l-6-r-12666741.pdf?src-supplier=Mouser; ComponentLink4Description: https://datasheet.ciiva.com/12666/pyu-rc0402-51-rohs-l-6-r-12666741.pdf?src-supplier=Mouser; ComponentLink5URL: https://datasheet.ciiva.com/17063/pyu-rc0402-51-rohs-l-6-r-17063193.pdf?src-supplier=Future+Electronics; ComponentLink5Description: https://datasheet.ciiva.com/17063/pyu-rc0402-51-rohs-l-6-r-17063193.pdf?src-supplier=Future+Electronics; ComponentLink6URL: https://datasheet.ciiva.com/7983/1018594-7983502.pdf?src-supplier=Element14; ComponentLink6Description: https://datasheet.ciiva.com/7983/1018594-7983502.pdf?src-supplier=Element14; ComponentLink7URL: https://datasheet.ciiva.com/7849/1018594-7849869.pdf?src-supplier=Element14; ComponentLink7Description: https://datasheet.ciiva.com/7849/1018594-7849869.pdf?src-supplier=Element14; ComponentLink8URL: https://datasheet.ciiva.com/7849/1018594-7849871.pdf?src-supplier=Element14; ComponentLink8Description: https://datasheet.ciiva.com/7849/1018594-7849871.pdf?src-supplier=Element14; LCSC Part Number: C106235
R5 = RC0201FR-0756K2L: RES 56.2K OHM 1% 1/20W 0201; Manufacturer: Yageo; Additional Feature: LASER TRIMMABLE; Power: 50mW; Rated Temperature: 70°C; Value: 56.2kR; Working Voltage: 25V; Temperature Coefficient (ppm/Cel): 200; Package Height: 0.23mm; Package Length: 0.6mm; Package Width: 0.3mm; Supplier: Digikey; Supplier Part Number: YAG2731CT-ND; Manufacturer Part Number: RC0201FR-0756K2L; RoHS: Yes; Category: Chip SMD Resistors; Stock: 71668; Pricing: 1=0.1, 10=0.009, 100=0.0071, 1000=0.00561 (USD); Mounting Technology: Surface Mount; Pins: 2; Package Shape: Rectangular; Case/Package: 0201; Terminal Finish: Nickel; Min Operating Temperature: -55°C; Max Operating Temperature: 125°C; Tolerance: 1%; JESD-609 Code: e3; Resistor Type: FIXED RESISTOR; Construction: Chip; Packaging: Tape and Reel; Technology: METAL GLAZE/THICK FILM; Termination: Wraparound; Reach SVHC Compliant: Yes; RoHS Compliant: Yes; ComponentLink1URL: https://datasheet.ciiva.com:443/pdfs/VipMasterIC/IC/YAGO/YAGO-S-A0008145938/YAGO-S-A0008145938-1.pdf?src-supplier=IHS+Markit; ComponentLink1Description: https://datasheet.ciiva.com:443/pdfs/VipMasterIC/IC/YAGO/YAGO-S-A0008145938/YAGO-S-A0008145938-1.pdf?src-supplier=IHS+Markit; ComponentLink2URL: https://datasheet.octopart.com/RC0201FR-0756K2L-Yageo-datasheet-164759695.pdf?src-supplier=Future+Electronics; ComponentLink2Description: https://datasheet.octopart.com/RC0201FR-0756K2L-Yageo-datasheet-164759695.pdf?src-supplier=Future+Electronics; ComponentLink3URL: http://www.yageo.com/documents/recent/PYu-RC_Group_51_RoHS_L_9.pdf?src-supplier=Digikey; ComponentLink3Description: http://www.yageo.com/documents/recent/PYu-RC_Group_51_RoHS_L_9.pdf?src-supplier=Digikey; ComponentLink4URL: http://www.yageo.com/documents/recent/PYu-RC_Group_51_RoHS_L_10.pdf?src-supplier=Digikey; ComponentLink4Description: http://www.yageo.com/documents/recent/PYu-RC_Group_51_RoHS_L_10.pdf?src-supplier=Digikey; ComponentLink5URL: https://www.yageo.com/upload/media/product/productsearch/datasheet/rchip/PYu-RC_Group_51_RoHS_L_11.pdf?src-supplier=Digikey; ComponentLink5Description: https://www.yageo.com/upload/media/product/productsearch/datasheet/rchip/PYu-RC_Group_51_RoHS_L_11.pdf?src-supplier=Digikey; LCSC Part Number: C327383
R9 R10 R17 R21 = RC0402FR-070RL: Fixed Resistor, Metal Glaze/thick Film, 0.0625W, 0ohm, Surface Mount, 0402; Manufacturer: Yageo; Power: 62.5mW; Rated Temperature: 70°C; Supplier: Digikey; Supplier Part Number: 311-0.0LRCT-ND; Manufacturer Part Number: RC0402FR-070RL; RoHS: Yes; Category: Chip SMD Resistors; Stock: 1108415; Pricing: 1=0.1, 10=0.01, 25=0.0064, 50=0.0054, 100=0.0047, 250=0.00392, 500=0.00346, 1000=0.00304, 5000=0.0023, 10000=0.00206, 20000=0.00185, 30000=0.00175, 50000=0.00163, 70000=0.00155, 100000=0.00148, 250000=0.00133, 500000=0.00123, 1000000=0.00115 (USD); Mounting Technology: Surface Mount; Pins: 2; Package Shape: Rectangular; Case/Package: 0402; Terminal Finish: Nickel; Min Operating Temperature: -55°C; Max Operating Temperature: 155°C; JESD-609 Code: e3; Resistor Type: FIXED RESISTOR; Packaging: Tape and Reel; Value: 0R; Technology: METAL GLAZE/THICK FILM; Termination: Wraparound; Reach SVHC Compliant: Yes; RoHS Compliant: Yes; ComponentLink1URL: https://datasheet.ciiva.com:443/pdfs/VipMasterIC/IC/YAGO/YAGOS02562/YAGOS02562-1.pdf?src-supplier=IHS+Markit; ComponentLink1Description: https://datasheet.ciiva.com:443/pdfs/VipMasterIC/IC/YAGO/YAGOS02562/YAGOS02562-1.pdf?src-supplier=IHS+Markit; ComponentLink2URL: https://datasheet.ciiva.com/16790/pyu-rc0402-51-rohs-l-6-r-16790444.pdf?src-supplier=Future+Electronics; ComponentLink2Description: https://datasheet.ciiva.com/16790/pyu-rc0402-51-rohs-l-6-r-16790444.pdf?src-supplier=Future+Electronics; LCSC Part Number: C106231
R11 R57 = RC0201FR-0710KL: RES 10K OHM 1% 1/20W 0201; Manufacturer: Yageo; Additional Feature: LASER TRIMMABLE; Power: 50mW; Rated Temperature: 70°C; Value: 10kR; Working Voltage: 25V; Temperature Coefficient (ppm/Cel): 200; Package Height: 0.23mm; Package Length: 0.6mm; Package Width: 0.3mm; Supplier: Digikey; Supplier Part Number: 311-10.0KMCT-ND; Manufacturer Part Number: RC0201FR-0710KL; RoHS: Yes; Category: Chip SMD Resistors; Pricing: 1=0.1, 10=0.009, 100=0.0071, 1000=0.00612 (USD); Mounting Technology: Surface Mount; Pins: 2; Package Shape: Rectangular; Case/Package: 0201; Terminal Finish: Nickel; Min Operating Temperature: -55°C; Max Operating Temperature: 125°C; Tolerance: 1%; JESD-609 Code: e3; Resistor Type: FIXED RESISTOR; Construction: Chip; Packaging: Tape and Reel; Technology: METAL GLAZE/THICK FILM; Termination: Wraparound; Reach SVHC Compliant: Yes; RoHS Compliant: Yes; ComponentLink1URL: https://datasheet.ciiva.com:443/pdfs/VipMasterIC/IC/YAGO/YAGO-S-A0008145938/YAGO-S-A0008145938-1.pdf?src-supplier=IHS+Markit; ComponentLink1Description: https://datasheet.ciiva.com:443/pdfs/VipMasterIC/IC/YAGO/YAGO-S-A0008145938/YAGO-S-A0008145938-1.pdf?src-supplier=IHS+Markit; ComponentLink2URL: https://datasheet.ciiva.com/7660/1421516-7660807.pdf?src-supplier=Element14; ComponentLink2Description: https://datasheet.ciiva.com/7660/1421516-7660807.pdf?src-supplier=Element14; ComponentLink3URL: https://datasheet.ciiva.com/46391/1421516-46391339.pdf?src-supplier=Element14; ComponentLink3Description: https://datasheet.ciiva.com/46391/1421516-46391339.pdf?src-supplier=Element14; ComponentLink4URL: https://datasheet.ciiva.com/2467/pyu-r-int-thick-7-2467110.pdf?src-supplier=Digikey; ComponentLink4Description: https://datasheet.ciiva.com/2467/pyu-r-int-thick-7-2467110.pdf?src-supplier=Digikey; ComponentLink5URL: https://datasheet.ciiva.com/2467/pyu-r-int-thick-7-2467111.pdf?src-supplier=Digikey; ComponentLink5Description: https://datasheet.ciiva.com/2467/pyu-r-int-thick-7-2467111.pdf?src-supplier=Digikey; ComponentLink6URL: https://datasheet.ciiva.com/2467/pyu-r-int-thick-7-2467109.pdf?src-supplier=Digikey; ComponentLink6Description: https://datasheet.ciiva.com/2467/pyu-r-int-thick-7-2467109.pdf?src-supplier=Digikey; ComponentLink7URL: https://datasheet.ciiva.com/8891/pyu-rc0201-51-rohs-l-8-8891384.pdf?src-supplier=Avnet; ComponentLink7Description: https://datasheet.ciiva.com/8891/pyu-rc0201-51-rohs-l-8-8891384.pdf?src-supplier=Avnet; ComponentLink8URL: https://datasheet.ciiva.com/26829/getdatasheetpartid-421074-26829851.pdf?src-supplier=Verical; ComponentLink8Description: https://datasheet.ciiva.com/26829/getdatasheetpartid-421074-26829851.pdf?src-supplier=Verical; LCSC Part Number: C106225
R12 R15 R16 R19 R20 R58 R59 = RC0402FR-0727RL: Fixed Resistor, Metal Glaze/thick Film, 0.0625W, 27ohm, 50V, 1% +/-Tol, 100ppm/Cel, Surface Mount, 0402; Manufacturer: Yageo; Additional Feature: LASER TRIMMABLE; Power: 62.5mW; Rated Temperature: 70°C; Temperature Coefficient (ppm/Cel): 100; Package Height: 0.35mm; Package Length: 1mm; Package Width: 0.5mm; Supplier: Digikey; Supplier Part Number: YAG3086CT-ND; Manufacturer Part Number: RC0402FR-0727RL; RoHS: Yes; Category: Chip SMD Resistors; Stock: 156051; Pricing: 1=0.1, 10=0.007, 100=0.0061, 1000=0.00408, 2500=0.00357 (USD); Mounting Technology: Surface Mount; Pins: 2; Package Shape: Rectangular; Case/Package: 0402; Terminal Finish: Nickel; Min Operating Temperature: -55°C; Max Operating Temperature: 155°C; Tolerance: 1%; JESD-609 Code: e3; Resistor Type: FIXED RESISTOR; Construction: Chip; Packaging: Tape and Reel; Value: 27R; Technology: METAL GLAZE/THICK FILM; Termination: Wraparound; Working Voltage: 50V; Reach SVHC Compliant: Yes; RoHS Compliant: Yes; ComponentLink1URL: https://datasheet.ciiva.com:443/pdfs/VipMasterIC/IC/YAGO/YAGO-S-A0008145938/YAGO-S-A0008145938-1.pdf?src-supplier=IHS+Markit; ComponentLink1Description: https://datasheet.ciiva.com:443/pdfs/VipMasterIC/IC/YAGO/YAGO-S-A0008145938/YAGO-S-A0008145938-1.pdf?src-supplier=IHS+Markit; ComponentLink2URL: https://datasheet.ciiva.com/11808/0900766b80c66297-11808450.pdf?src-supplier=Rs; ComponentLink2Description: https://datasheet.ciiva.com/11808/0900766b80c66297-11808450.pdf?src-supplier=Rs; ComponentLink3URL: https://datasheet.ciiva.com/7849/1018594-7849927.pdf?src-supplier=Element14; ComponentLink3Description: https://datasheet.ciiva.com/7849/1018594-7849927.pdf?src-supplier=Element14; ComponentLink4URL: https://datasheet.ciiva.com/7849/1018594-7849926.pdf?src-supplier=Element14; ComponentLink4Description: https://datasheet.ciiva.com/7849/1018594-7849926.pdf?src-supplier=Element14; ComponentLink5URL: https://datasheet.ciiva.com/17044/pyu-rc0402-51-rohs-l-6-17044345.pdf?src-supplier=Future+Electronics; ComponentLink5Description: https://datasheet.ciiva.com/17044/pyu-rc0402-51-rohs-l-6-17044345.pdf?src-supplier=Future+Electronics; ComponentLink6URL: https://datasheet.ciiva.com/15189/getdatasheetpartid-327852-15189402.pdf?src-supplier=Verical; ComponentLink6Description: https://datasheet.ciiva.com/15189/getdatasheetpartid-327852-15189402.pdf?src-supplier=Verical; LCSC Part Number: C138021
R18 = RC0402FR-7W10KL: RES 10K OHM 1% 1/8W 0402; Manufacturer: Yageo Group; Value: 10kΩ; Working Voltage: 50V; Power Dissipation: 125mW; Temperature Coefficient: 200ppm/°C; Supplier: DigiKey; Supplier Part Number: 13-RC0402FR-7W10KLCT-ND; Manufacturer Part Number: RC0402FR-7W10KL; RoHS: Compliant; Category: Chip SMD Resistors; Stock: 92569; Pricing: 1=0.1, 10=0.010, 25=0.0092, 50=0.0082, 100=0.0066, 250=0.00408 (USD); Mounting Technology: Surface Mount; Case/Package: 0402; Min Operating Temperature: -55°C; Max Operating Temperature: 155°C; Tolerance: 1%; Packaging: Tape & Reel; ComponentLink1URL: https://datasheet.octopart.com:443/RC0402FR-7W10KL-Yageo-datasheet-175887523.pdf?src-supplier=Newark; ComponentLink1Description: https://datasheet.octopart.com:443/RC0402FR-7W10KL-Yageo-datasheet-175887523.pdf?src-supplier=Newark; ComponentLink2URL: https://datasheet.octopart.com:443/RC0402FR-7W10KL-Yageo-datasheet-164759695.pdf?src-supplier=Future+Electronics; ComponentLink2Description: https://datasheet.octopart.com:443/RC0402FR-7W10KL-Yageo-datasheet-164759695.pdf?src-supplier=Future+Electronics; LCSC Part Number: C851848; China RoHS: Non-Compliant; Height: 350µm; Lifecycle Status: Production; Number of Terminals: 2; REACH SVHC: Yes; Width: 500µm; ComponentLink3URL: https://datasheet.octopart.com:443/RC0402FR-7W10KL-Yageo-datasheet-141265859.pdf?src-supplier=Future+Electronics; ComponentLink3Description: https://datasheet.octopart.com:443/RC0402FR-7W10KL-Yageo-datasheet-141265859.pdf?src-supplier=Future+Electronics; ComponentLink4URL: https://datasheet.octopart.com/RC0402FR-7W10KL-Yageo-datasheet-73766026.pdf; ComponentLink4Description: https://datasheet.octopart.com/RC0402FR-7W10KL-Yageo-datasheet-73766026.pdf; ComponentLink5URL: http://sigma.octopart.com:80/conflict_mineral_statement/Yageo-company-3.pdf?src-supplier=Compliance+Statements; ComponentLink5Description: http://sigma.octopart.com:80/conflict_mineral_statement/Yageo-company-3.pdf?src-supplier=Compliance+Statements; ComponentLink6URL: http://sigma.octopart.com:80/rohs_statement/Yageo-company-2.pdf?src-supplier=Compliance+Statements; ComponentLink6Description: http://sigma.octopart.com:80/rohs_statement/Yageo-company-2.pdf?src-supplier=Compliance+Statements
R22 = RC0402FR-074K7L: Fixed Resistor, Metal Glaze/thick Film, 0.0625W, 4700ohm, 50V, 1% +/-Tol, 100ppm/Cel, Surface Mount, 0402; Manufacturer: Yageo; Additional Feature: LASER TRIMMABLE; Power: 62.5mW; Rated Temperature: 70°C; Value: 4.7kR; Temperature Coefficient (ppm/Cel): 100; Package Height: 0.35mm; Package Length: 1mm; Package Width: 0.5mm; Supplier: Digikey; Supplier Part Number: 311-4.7KLRCT-ND; Manufacturer Part Number: RC0402FR-074K7L; RoHS: Yes; Category: Chip SMD Resistors; Stock: 1594505; Pricing: 1=0.1, 10=0.02, 100=0.009, 1000=0.00474, 2500=0.00381, 5000=0.00328 (USD); Mounting Technology: Surface Mount; Pins: 2; Package Shape: Rectangular; Case/Package: 0402; Terminal Finish: Nickel; Min Operating Temperature: -55°C; Max Operating Temperature: 155°C; Tolerance: 1%; JESD-609 Code: e3; Resistor Type: FIXED RESISTOR; Construction: Chip; Packaging: Tape and Reel; Technology: METAL GLAZE/THICK FILM; Termination: Wraparound; Working Voltage: 50V; Reach SVHC Compliant: Yes; RoHS Compliant: Yes; ComponentLink1URL: https://datasheet.ciiva.com:443/pdfs/VipMasterIC/IC/YAGO/YAGO-S-A0008145938/YAGO-S-A0008145938-1.pdf?src-supplier=IHS+Markit; ComponentLink1Description: https://datasheet.ciiva.com:443/pdfs/VipMasterIC/IC/YAGO/YAGO-S-A0008145938/YAGO-S-A0008145938-1.pdf?src-supplier=IHS+Markit; ComponentLink2URL: https://datasheet.ciiva.com/22661/1686128-22661342.pdf?src-supplier=Element14; ComponentLink2Description: https://datasheet.ciiva.com/22661/1686128-22661342.pdf?src-supplier=Element14; ComponentLink3URL: https://datasheet.ciiva.com/7850/1018594-7850022.pdf?src-supplier=Element14; ComponentLink3Description: https://datasheet.ciiva.com/7850/1018594-7850022.pdf?src-supplier=Element14; ComponentLink4URL: https://datasheet.ciiva.com/7850/1018594-7850023.pdf?src-supplier=Element14; ComponentLink4Description: https://datasheet.ciiva.com/7850/1018594-7850023.pdf?src-supplier=Element14; LCSC Part Number: C105871